# Altium schematic sheet Peripherals.SchDoc
size 355 x 266 mm; SheetNumber: 3; SheetTotal: 3
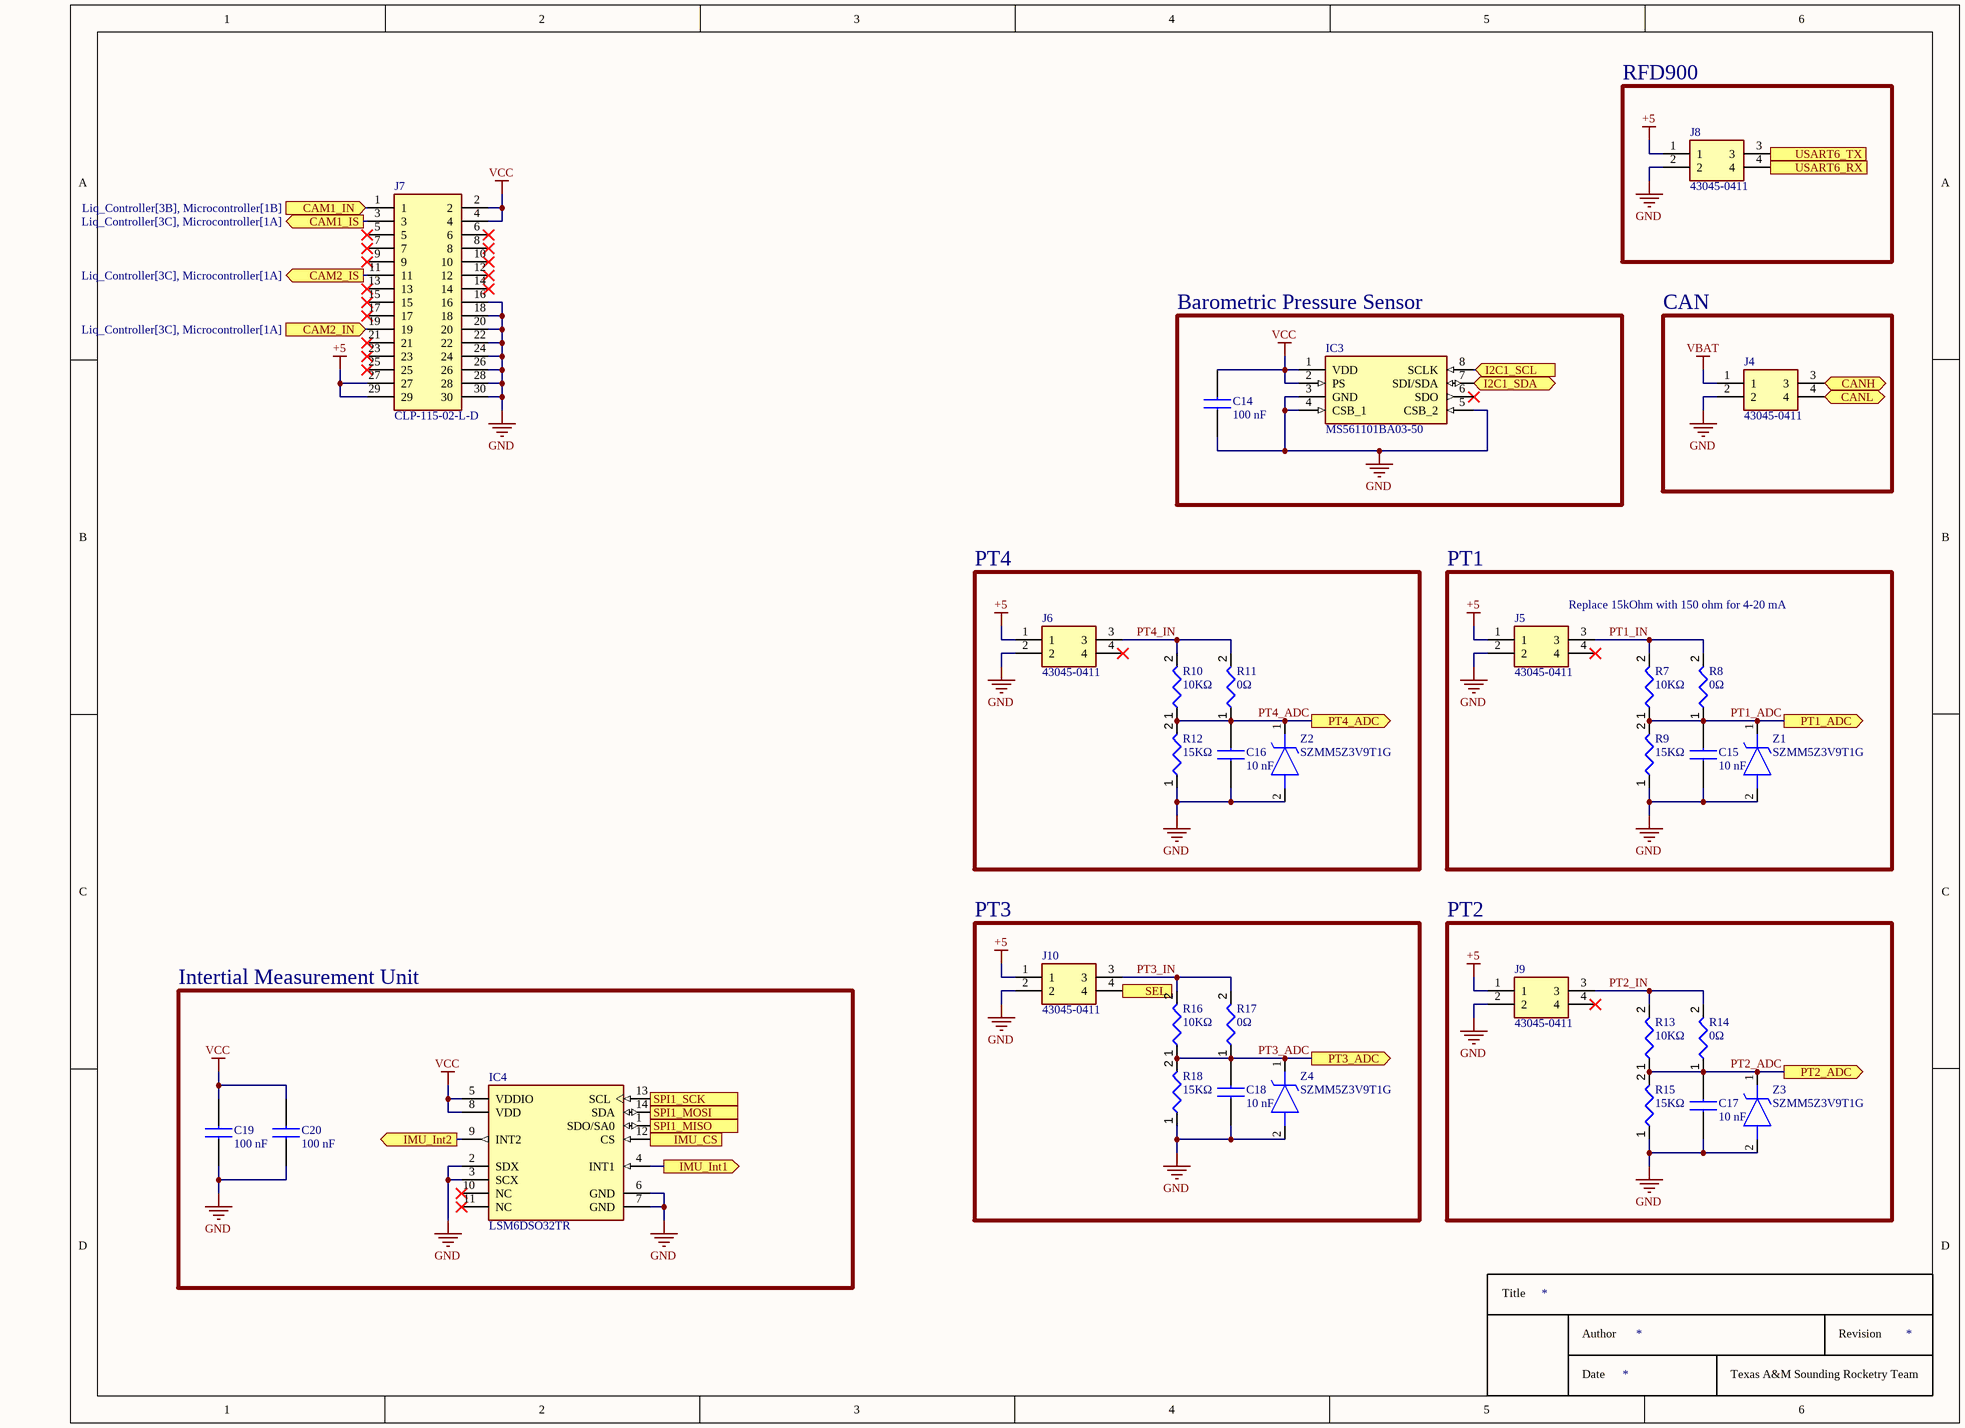
[diagram p0: Peripherals.SchDoc]

## Parts
C14  100 nF  [CAP_0603]
C15  10 nF  [CAP_0603]
C16  10 nF  [CAP_0603]
C17  10 nF  [CAP_0603]
C18  10 nF  [CAP_0603]
C19  100 nF  [CAP_0603]
C20  100 nF  [CAP_0603]
IC3  MS561101BA03-50  [MS561101BA03-50]
IC4  LSM6DSO32TR  [XDCR_LSM6DSO32TR]
J4  43045-0411  [43045-04YY_09101192]
J5  43045-0411  [43045-04YY_09101192]
J6  43045-0411  [43045-04YY_09101192]
J7  CLP-115-02-L-D  [CLP-115-02-XXX-D]
J8  43045-0411  [43045-04YY_09101192]
J9  43045-0411  [43045-04YY_09101192]
J10  43045-0411  [43045-04YY_09101192]
R7  10KΩ  [RES_0603]
R8  0Ω  [RES_0603]
R9  15KΩ  [RES_0603]
R10  10KΩ  [RES_0603]
R11  0Ω  [RES_0603]
R12  15KΩ  [RES_0603]
R13  10KΩ  [RES_0603]
R14  0Ω  [RES_0603]
R15  15KΩ  [RES_0603]
R16  10KΩ  [RES_0603]
R17  0Ω  [RES_0603]
R18  15KΩ  [RES_0603]
Z1  SZMM5Z3V9T1G  [SODFL1608X70N]
Z2  SZMM5Z3V9T1G  [SODFL1608X70N]
Z3  SZMM5Z3V9T1G  [SODFL1608X70N]
Z4  SZMM5Z3V9T1G  [SODFL1608X70N]

## Blocks framed on the sheet
RFD900: J8
Barometric Pressure Sensor: C14 IC3
CAN: J4
PT4: C16 J6 R10-R12 Z2
PT1: C15 J5 R7-R9 Z1
PT3: C18 J10 R16-R18 Z4
PT2: C17 J9 R13-R15 Z3
Intertial Measurement Unit: C19 C20 IC4

## Ports
CAM1_IN (in, see Liq_Controller[3B], Microcontroller[1B]), CAM1_IS (out, see Liq_Controller[3C], Microcontroller[1A]), CAM2_IN (in, see Liq_Controller[3C], Microcontroller[1A]), CAM2_IS (out, see Liq_Controller[3C], Microcontroller[1A]), CANH (bidir, see Liq_Controller[3B], Microcontroller[5B]), CANL (bidir, see Liq_Controller[3B], Microcontroller[5B]), I2C1_SCL (in, see Liq_Controller[3A], Microcontroller[2A]), I2C1_SDA (bidir, see Liq_Controller[3A], Microcontroller[2A]), IMU_CS (in, see Liq_Controller[3B], Microcontroller[1B]), IMU_Int1 (out, see Liq_Controller[3B], Microcontroller[1B]), IMU_Int2 (out, see Liq_Controller[3B], Microcontroller[1B]), PT1_ADC (out, see Liq_Controller[3B], Microcontroller[1B]), PT2_ADC (out, see Liq_Controller[3B], Microcontroller[1B]), PT3_ADC (out, see Liq_Controller[3B], Microcontroller[2A]), PT4_ADC (out, see Liq_Controller[3B], Microcontroller[2A]), SEL (out, see Liq_Controller[3B], Microcontroller[2A]), SPI1_MISO (out, see Liq_Controller[3B], Microcontroller[1A]), SPI1_MOSI (in, see Liq_Controller[3B], Microcontroller[1A]), SPI1_SCK (in, see Liq_Controller[3B], Microcontroller[1A]), USART6_RX (out, see Liq_Controller[3B], Microcontroller[1B]), USART6_TX (in, see Liq_Controller[3B], Microcontroller[1B])

## Nets
+5: J5.1 J6.1 J7.27 J7.29 J8.1 J9.1 J10.1
GND: C14.1 C15.1 C16.1 C17.1 C18.1 C19.1 C20.1 IC3.3(GND) IC3.4(CSB_1) IC3.5(CSB_2) IC4.2(SDX) IC4.3(SCX) IC4.6(GND) IC4.7(GND) J4.2 J5.2 J6.2 J7.16 J7.18 J7.20 J7.22 J7.24 J7.26 J7.28 J7.30 J8.2 J9.2 J10.2 R9.1 R12.1 R15.1 R18.1 Z1.2(A) Z2.2(A) Z3.2(A) Z4.2(A)
VBAT: J4.1
VCC: C14.2 C19.2 C20.2 IC3.1(VDD) IC3.2(PS) IC4.5(VDDIO) IC4.8(VDD) J7.2 J7.4
CAM1_IN: J7.1 ; port CAM1_IN
CAM1_IS: J7.3 ; port CAM1_IS
CAM2_IN: J7.19 ; port CAM2_IN
CAM2_IS: J7.11 ; port CAM2_IS
CANH: J4.3 ; port CANH
CANL: J4.4 ; port CANL
I2C1_SCL: IC3.8(SCLK) ; port I2C1_SCL
I2C1_SDA: IC3.7(SDI/SDA) ; port I2C1_SDA
IMU_CS: IC4.12(CS) ; port IMU_CS
IMU_Int1: IC4.4(INT1) ; port IMU_Int1
IMU_Int2: IC4.9(INT2) ; port IMU_Int2
PT1_ADC: C15.2 R7.1 R8.1 R9.2 Z1.1(K) ; port PT1_ADC
PT1_IN: J5.3 R7.2 R8.2
PT2_ADC: C17.2 R13.1 R14.1 R15.2 Z3.1(K) ; port PT2_ADC
PT2_IN: J9.3 R13.2 R14.2
PT3_ADC: C18.2 R16.1 R17.1 R18.2 Z4.1(K) ; port PT3_ADC
PT3_IN: J10.3 R16.2 R17.2
PT4_ADC: C16.2 R10.1 R11.1 R12.2 Z2.1(K) ; port PT4_ADC
PT4_IN: J6.3 R10.2 R11.2
SEL: J10.4 ; port SEL
SPI1_MISO: IC4.1(SDO/SA0) ; port SPI1_MISO
SPI1_MOSI: IC4.14(SDA) ; port SPI1_MOSI
SPI1_SCK: IC4.13(SCL) ; port SPI1_SCK
USART6_RX: J8.4 ; port USART6_RX
USART6_TX: J8.3 ; port USART6_TX

Not connected (* = marked no-connect by the designer): IC3 6(SDO)*; IC4 10(NC)* 11(NC)*; J5 4*; J6 4*; J7 5* 6* 7* 8* 9* 10* 12* 13* 14* 15* 17* 21* 23* 25*; J9 4*

## Notes on the sheet
- (near J5) Replace 15kOhm with 150 ohm for 4-20 mA
- Title
- Author
- Date
- Texas A&M Sounding Rocketry Team
- Revision

## Library data of the parts
C14 = 100 nF Capacitor, 0603: Multilayer Ceramic Capacitors MLCC - SMD/SMT KGM15BR71H104JT NEW GLOBAL PN 50V 0.1uF A 581-KGM15BR71H104JT; Manufacturer 1: KYOCERA AVX; Manufacturer Part Number 1: 06035C104JAT2A; Tolerance: 5%; Value: 100 nF; Voltage: 50 V; Package: 0603; Library Ref: Capacitor_BASE; Design Item ID: 100 nF Capacitor, 0603; Supplier 1: Mouser; Supplier Part Number 1: 581-06035C104JAT2A
C15-C18 = 10 nF Capacitor, 0603: Multilayer Ceramic Capacitors MLCC - SMD/SMT KGM15AR71H103JM NEW GLOBAL PN 50V 0.01uF A 581-KGM15AR71H103JM; Manufacturer 1: KYOCERA AVX; Manufacturer Part Number 1: 06035C103JAT4A; MPN: 581-06035C103JAT4A; Tolerance: 5%; Value: 10 nF; Voltage: 50 V; Package: 0603; Library Ref: Capacitor_BASE; Design Item ID: 10 nF Capacitor, 0603; Supplier 1: Mouser
C19 C20 = 100 nF Capacitor, 0603: Multilayer Ceramic Capacitors MLCC - SMD/SMT KGM15BR71H104JT NEW GLOBAL PN 50V 0.1uF A 581-KGM15BR71H104JT; Manufacturer 1: KYOCERA AVX; Manufacturer Part Number 1: 06035C104JAT2A; MPN: 581-06035C104JAT2A; Tolerance: 5%; Value: 100 nF; Voltage: 50 V; Package: 0603; Library Ref: Capacitor_BASE; Design Item ID: 100 nF Capacitor, 0603; Supplier 1: Mouser
IC3 = MS561101BA03-50: Integrated Circuit; Manufacturer_Name: TE Connectivity; MPN: 824-MS561101BA03-50; Datasheet Link: https://www.te.com/commerce/DocumentDelivery/DDEController?Action=srchrtrv&DocNm=MS5611-01BA03&DocType=Data%20Sheet&DocLang=English&PartCntxt=MS561101BA03-50&DocFormat=pdf; Manufacturer_Part_Number: MS561101BA03-50; Mouser Price/Stock: https://www.mouser.co.uk/ProductDetail/Measurement-Specialties/MS561101BA03-50?qs=%252BgKeJhng5iV%252BnCz6Qd5iDw%3D%3D; Arrow Part Number: MS561101BA03-50; Arrow Price/Stock: https://www.arrow.com/en/products/ms561101ba03-50/te-connectivity?utm_currency=USD&region=nac; Supplier 1: Mouser; Supplier Part Number 1: 824-MS561101BA03-50
IC4 = LSM6DSO32TR: Accelerometer, Gyroscope, Temperature, 6 Axis Sensor IÂ²C, SPI Output; MPN: 511-LSM6DSO32TR; MF: STMicroelectronics; SnapEDA_Link: https://www.snapeda.com/parts/LSM6DSO32TR/STMicroelectronics/view-part/?ref=snap; Package: VFLGA-14 STMicroelectronics; Value: *; Check_prices: https://www.snapeda.com/parts/LSM6DSO32TR/STMicroelectronics/view-part/?ref=eda
J4-J6 J8-J10 = 43045-0411: Connector; Manufacturer_Name: Molex; Datasheet Link: https://www.molex.com/pdm_docs/sd/430450209_sd.pdf; Height: 8.77mm; Manufacturer_Part_Number: 43045-0411; Mouser Part Number: 538-43045-0411; Mouser Price/Stock: https://www.mouser.co.uk/ProductDetail/Molex/43045-0411?qs=UeCeOHRHQeZrBAGCFCweeA%3D%3D
J7 = CLP-115-02-L-D: 2x15 Board to Board; Manufacturer_Name: SAMTEC; Datasheet Link: https://www.samtec.com/products/clp; Manufacturer_Part_Number: CLP-115-02-L-D; Mouser Part Number: 200-CLP11502LD; Mouser Price/Stock: https://www.mouser.co.uk/ProductDetail/Samtec/CLP-115-02-L-D?qs=0lQeLiL1qyYF3PC5crt2Dg%3D%3D; Arrow Part Number: CLP-115-02-L-D; Arrow Price/Stock: https://www.arrow.com/en/products/clp-115-02-l-d/samtec
R7 R10 R13 R16 = 10 KOhm Resistor: Thick Film Resistors - SMD General Purpose Chip Resistor 0603, 10kOhms, 1%, 1/10W; Manufacturer 1: YAGEO; Manufacturer Part Number 1: RC0603FR-0710KL; MPN: 603-RC0603FR-0710KL; Tolerance: 0.01; Power: 0.1W; Value: 10KΩ; Package: 0603; Library Ref: Resistor_BASE; Design Item ID: 10 KOhm Resistor; Supplier 1: Mouser
R8 R11 R14 R17 = 0 Ohm Resistor: Thick Film Resistors - SMD General Purpose Chip Resistor 0603, 0Ohms, 1%, 1/10W; Manufacturer 1: YAGEO; Manufacturer Part Number 1: RC0603FR-070RL; MPN: 603-RC0603FR-070RL; Tolerance: 0.01; Power: 0.1W; Value: 0Ω; Package: 0603; Library Ref: Resistor_BASE; Design Item ID: 0 Ohm Resistor; Supplier 1: Mouser
R9 R12 R15 R18 = 15 KOhm Resistor: Thick Film Resistors - SMD General Purpose Chip Resistor 0603, 15kOhms, 1%, 1/10W; Manufacturer 1: YAGEO; Manufacturer Part Number 1: RC0603FR-0715KL; MPN: 603-RC0603FR-0715KL; Tolerance: 0.01; Power: 0.1W; Value: 15KΩ; Package: 0603; Library Ref: Resistor_BASE; Design Item ID: 15 KOhm Resistor; Supplier 1: Mouser
Z1-Z4 = SZMM5Z3V9T1G: Zener Diode; Manufacturer_Name: onsemi; Datasheet Link: https://www.onsemi.com/pub/Collateral/MM5Z2V4T1-D.PDF; Height: 0.7mm; Manufacturer_Part_Number: SZMM5Z3V9T1G; Mouser Part Number: 863-SZMM5Z3V9T1G; Mouser Price/Stock: https://www.mouser.co.uk/ProductDetail/ON-Semiconductor/SZMM5Z3V9T1G?qs=tCMd4XlZ%2FiBFVFj5mgJKfg%3D%3D; Arrow Part Number: SZMM5Z3V9T1G; Arrow Price/Stock: https://www.arrow.com/en/products/szmm5z3v9t1g/on-semiconductor